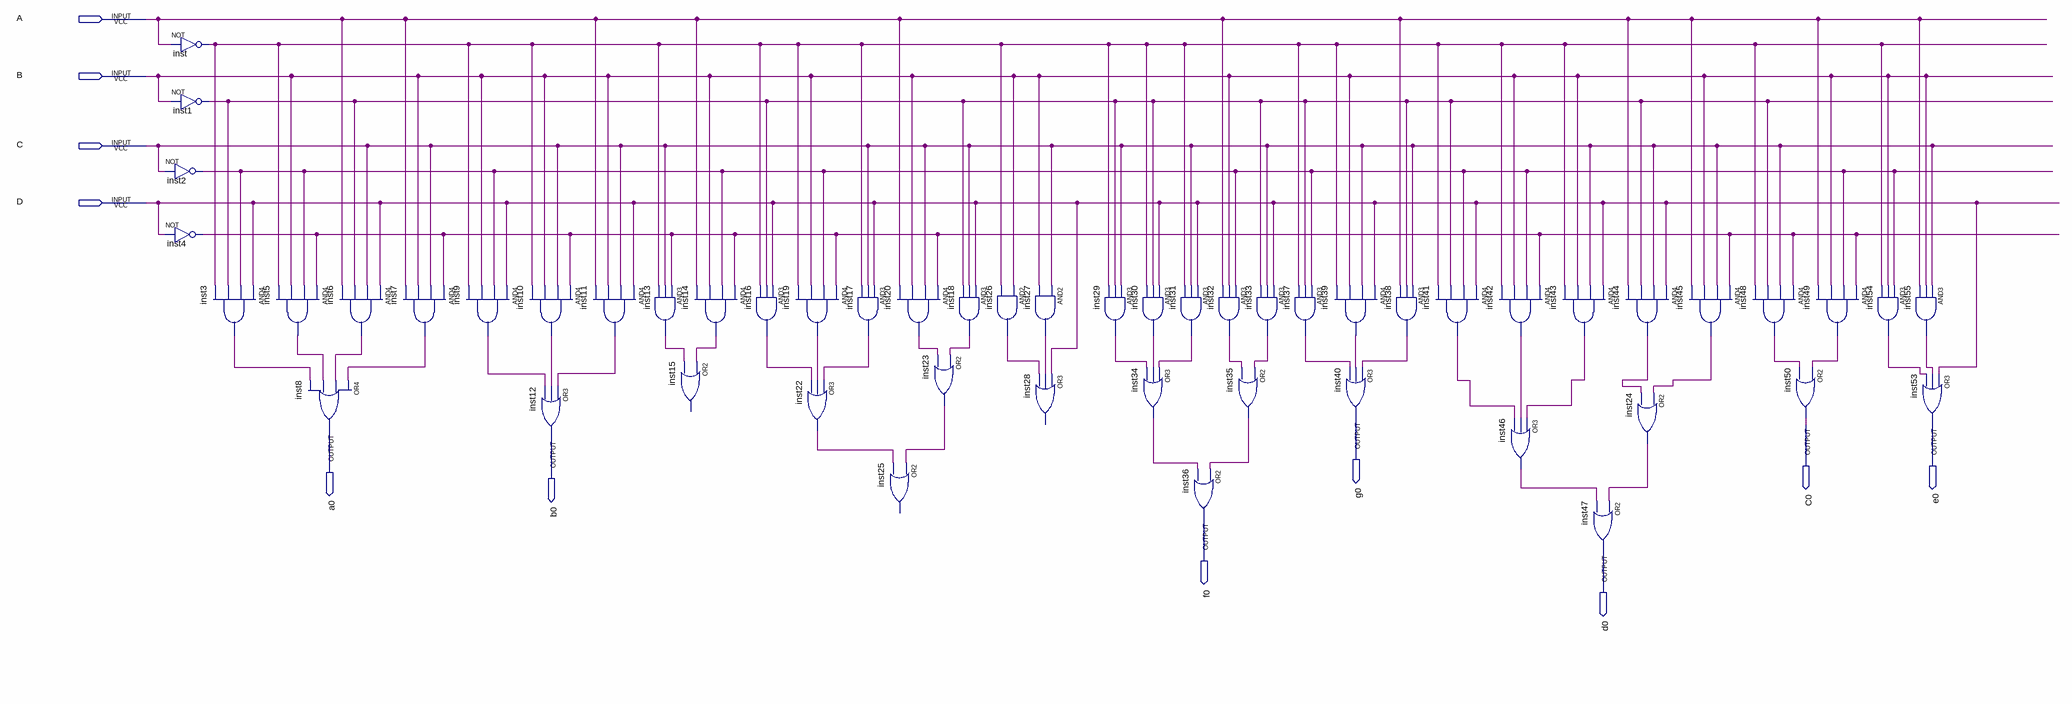
[diagram p0: schematic sheet]
// Quartus schematic unidade.bdf as structural Verilog: 53 symbols, 11 pins
module unidade (
  input  A,
  input  B,
  input  C,
  input  D,
  output g0,
  output C0,
  output e0,
  output a0,
  output b0,
  output f0,
  output d0
);

  wire inst1_out, inst2_out, inst3_out, inst4_out, inst5_out, inst6_out, inst7_out, inst9_out, inst10_out,
       inst11_out, inst13_out, inst14_out, inst16_out, inst17_out, inst18_out, inst19_out, inst20_out,
       inst22_out, inst23_out, inst24_out, inst26_out, inst27_out, inst29_out, inst30_out, inst31_out,
       inst32_out, inst33_out, inst34_out, inst35_out, inst37_out, inst38_out, inst39_out, inst41_out,
       inst42_out, inst43_out, inst44_out, inst45_out, inst46_out, inst48_out, inst49_out, inst54_out,
       inst55_out, inst_out;

  not inst (inst_out, A);
  not inst1 (inst1_out, B);
  not inst2 (inst2_out, C);
  not inst4 (inst4_out, D);
  and inst3 (inst3_out, D, inst2_out, inst1_out, inst_out);
  and inst5 (inst5_out, inst4_out, inst2_out, B, inst_out);
  and inst6 (inst6_out, D, C, inst1_out, A);
  or inst8 (a0, inst7_out, inst6_out, inst5_out, inst3_out);
  and inst7 (inst7_out, inst4_out, C, B, A);
  and inst9 (inst9_out, D, inst2_out, B, inst_out);
  and inst10 (inst10_out, inst4_out, C, B, inst_out);
  or inst12 (b0, inst11_out, inst10_out, inst9_out);
  and inst11 (inst11_out, D, C, B, A);
  and inst13 (inst13_out, inst4_out, C, inst_out);
  and inst14 (inst14_out, inst4_out, inst2_out, B, A);
  // OR2 inst15 has open pins: IN1=inst14_out, IN2=inst13_out, OUT=open
  and inst16 (inst16_out, D, inst1_out, inst_out);
  and inst19 (inst19_out, inst4_out, inst2_out, B, inst_out);
  or inst22 (inst22_out, inst17_out, inst19_out, inst16_out);
  and inst20 (inst20_out, inst4_out, C, B, A);
  and inst17 (inst17_out, D, C, inst_out);
  // OR2 inst25 has open pins: IN1=inst23_out, IN2=inst22_out, OUT=open
  or inst23 (inst23_out, inst18_out, inst20_out);
  and inst18 (inst18_out, D, C, inst1_out);
  and inst26 (inst26_out, B, inst_out);
  and inst27 (inst27_out, C, B);
  // OR3 inst28 has open pins: IN1=D, IN2=inst27_out, IN3=inst26_out, OUT=open
  and inst29 (inst29_out, C, inst1_out, inst_out);
  and inst30 (inst30_out, D, inst1_out, inst_out);
  or inst34 (inst34_out, inst31_out, inst30_out, inst29_out);
  and inst31 (inst31_out, D, C, inst_out);
  or inst36 (f0, inst35_out, inst34_out);
  and inst33 (inst33_out, D, C, inst1_out);
  and inst32 (inst32_out, inst2_out, B, A);
  or inst35 (inst35_out, inst33_out, inst32_out);
  and inst37 (inst37_out, inst2_out, inst1_out, inst_out);
  and inst39 (inst39_out, D, C, B, inst_out);
  or inst40 (g0, inst38_out, inst39_out, inst37_out);
  and inst38 (inst38_out, C, inst1_out, A);
  and inst41 (inst41_out, D, inst2_out, inst1_out, inst_out);
  and inst42 (inst42_out, inst4_out, inst2_out, B, inst_out);
  or inst46 (inst46_out, inst43_out, inst42_out, inst41_out);
  and inst43 (inst43_out, D, C, B, inst_out);
  or inst47 (d0, inst24_out, inst46_out);
  and inst44 (inst44_out, D, C, inst1_out, A);
  or inst24 (inst24_out, inst45_out, inst44_out);
  and inst45 (inst45_out, inst4_out, C, B, A);
  and inst48 (inst48_out, inst4_out, C, inst1_out, inst_out);
  and inst49 (inst49_out, inst4_out, inst2_out, B, A);
  or inst50 (C0, inst49_out, inst48_out);
  and inst54 (inst54_out, inst2_out, B, inst_out);
  and inst55 (inst55_out, C, B, A);
  or inst53 (e0, D, inst55_out, inst54_out);
endmodule
